# Altium project PRO_TA_THI_THU_PHUONG.PrjPcb
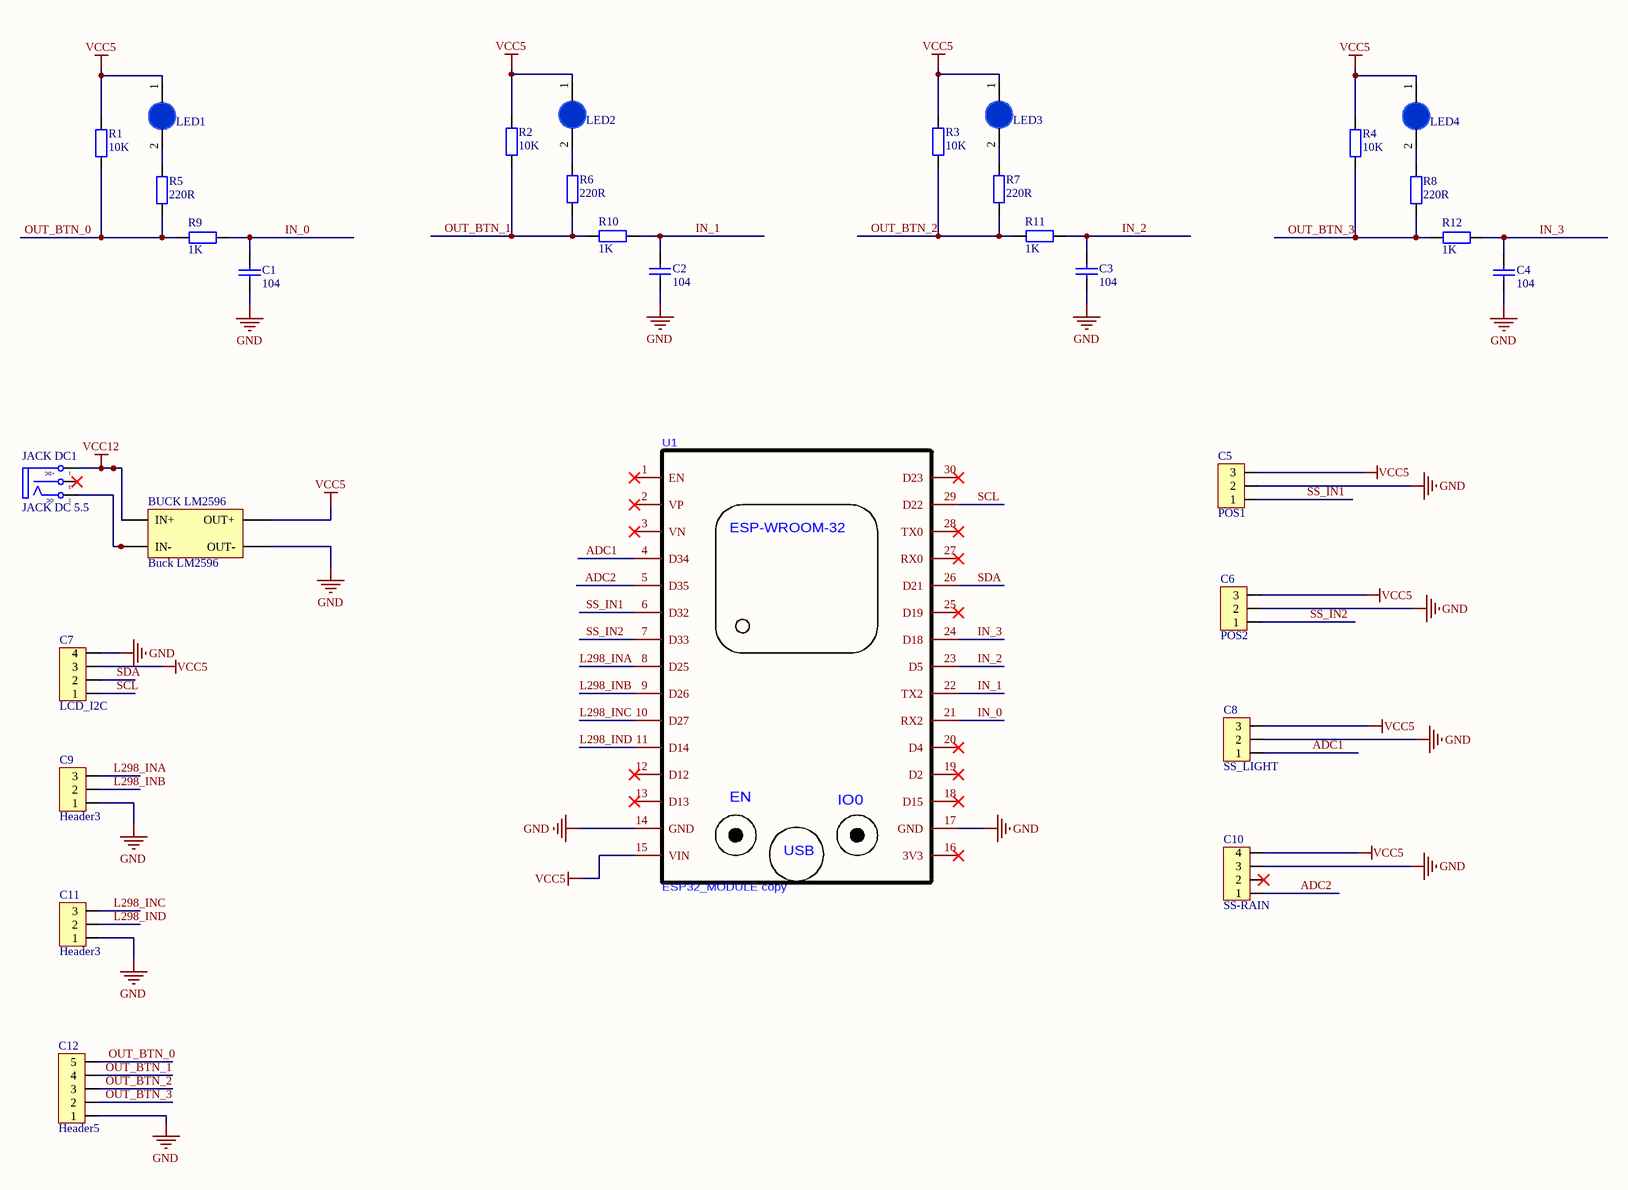
[diagram p0: SCHE_TA_THI_THU_PHUONG.SchDoc]
1 sheet, 31 parts. Net scope: global (net labels, ports and power ports of the same name join across sheets).
Board file: PCB_TA_THI_THU_PHUONG.PcbDoc

## Sheet SCHE_TA_THI_THU_PHUONG.SchDoc
size A2; SheetNumber: 1; SheetTotal: 1

### Parts
BUCK_LM2596  Buck LM2596  [BUCK LM2596]
C1  104  [tu gom]
C2  104  [tu gom]
C3  104  [tu gom]
C4  104  [tu gom]
C5  POS1  [Header3]
C6  POS2  [Header3]
C7  LCD_I2C  [Header4]
C8  SS_LIGHT  [Header3]
C9  Header3  [Header3]
C10  SS-RAIN  [Header4]
C11  Header3  [Header3]
C12  Header5  [Header5]
JACK_DC1  JACK DC 5.5  [JACK DC 5.5]
LED1  LED 3mm  [LED-3MM-BLUE]  (value not drawn)
LED2  LED 3mm  [LED-3MM-BLUE]  (value not drawn)
LED3  LED 3mm  [LED-3MM-BLUE]  (value not drawn)
LED4  LED 3mm  [LED-3MM-BLUE]  (value not drawn)
R1  10K  [R1/4W]
R2  10K  [R1/4W]
R3  10K  [R1/4W]
R4  10K  [R1/4W]
R5  220R  [R1/4W]
R6  220R  [R1/4W]
R7  220R  [R1/4W]
R8  220R  [R1/4W]
R9  1K  [R1/4W]
R10  1K  [R1/4W]
R11  1K  [R1/4W]
R12  1K  [R1/4W]
U1  ESP32_MODULE copy  [ESP32-WIFIMODULE-FOOTPRINT]

### Nets
GND: BUCK_LM2596.3(OUT-) C1.2 C2.2 C3.2 C4.2 C5.2 C6.2 C7.4 C8.2 C9.1 C10.3 C11.1 C12.1 U1.14(GND) U1.17(GND)
VCC5: BUCK_LM2596.4(OUT+) C5.3 C6.3 C7.3 C8.3 C10.4 LED1.1(A) LED2.1(A) LED3.1(A) LED4.1(A) R1.2 R2.2 R3.2 R4.2 U1.15(VIN)
VCC12: BUCK_LM2596.1(IN+) JACK_DC1.1(T)
ADC1: C8.1 U1.4(D34)
ADC2: C10.1 U1.5(D35)
IN_0: C1.1 R9.1 U1.21(RX2)
IN_1: C2.1 R10.1 U1.22(TX2)
IN_2: C3.1 R11.1 U1.23(D5)
IN_3: C4.1 R12.1 U1.24(D18)
L298_INA: C9.3 U1.8(D25)
L298_INB: C9.2 U1.9(D26)
L298_INC: C11.3 U1.10(D27)
L298_IND: C11.2 U1.11(D14)
OUT_BTN_0: C12.5 R1.1 R5.1 R9.2
OUT_BTN_1: C12.4 R2.1 R6.1 R10.2
OUT_BTN_2: C12.3 R3.1 R7.1 R11.2
OUT_BTN_3: C12.2 R4.1 R8.1 R12.2
SCL: C7.1 U1.29(D22)
SDA: C7.2 U1.26(D21)
SS_IN1: C5.1 U1.6(D32)
SS_IN2: C6.1 U1.7(D33)
NetBUCK_LM2596_2: BUCK_LM2596.2(IN-) JACK_DC1.2(TN)
NetLED1_2: LED1.2(K) R5.2
NetLED2_2: LED2.2(K) R6.2
NetLED3_2: LED3.2(K) R7.2
NetLED4_2: LED4.2(K) R8.2

Not connected (* = marked no-connect by the designer): C10 2*; JACK_DC1 3(S)*; U1 1(EN)* 2(VP)* 3(VN)* 12(D12)* 13(D13)* 16(3V3)* 18(D15)* 19(D2)* 20(D4)* 25(D19)* 27(RX0)* 28(TX0)* 30(D23)*

### Notes on the sheet
- (in symbol ESP32_MODULE copy) ESP-WROOM-32; IO0; USB
- (in symbol JACK DC 5.5) +DC; -DC

### Library data of the parts
C1-C4 = Tu gom 104 50V: Cắm; So_Chan: 2; Ten_Linh_Kien: Tụ gốm 104 100nF 50V; Don_Vi: Con; Ma_Hang: MH004761; Chung_Loai: Cắm; Kieu_Chan: *
C5 C6 C8 C9 C11 = Header3: Header IDC, 3 x 1 Pin Vertical 2.54mm Pitch (Non-Boxed, Male); Manufacturer: W¨¹rth Elektronik eiSos GmbH; partNo: 613002143121; ComponentLink1 Description: Manufacturer; ComponentLink2 Description: Datasheet; NoPins: 02; Created Date: 29 March 2013; ComponentLink1URL: http://www.we-online.com; ComponentLink2URL: http://katalog.we-online.de/em/datasheet/6130xx143121.pdf; Created by: Karrer Zheng
C7 C10 = Header4: Header IDC, 4 x 1 Pin Vertical 2.54mm Pitch (Non-Boxed, Male); Manufacturer: W¨¹rth Elektronik eiSos GmbH; partNo: 613002143121; ComponentLink1 Description: Manufacturer; ComponentLink2 Description: Datasheet; NoPins: 02; Created Date: 29 March 2013; ComponentLink1URL: http://www.we-online.com; ComponentLink2URL: http://katalog.we-online.de/em/datasheet/6130xx143121.pdf; Created by: Karrer Zheng
C12 = Header5: Header IDC, 5 x 1 Pin Vertical 2.54mm Pitch (Non-Boxed, Male); Manufacturer: W¨¹rth Elektronik eiSos GmbH; partNo: 613002143121; ComponentLink1 Description: Manufacturer; ComponentLink2 Description: Datasheet; NoPins: 02; Created Date: 29 March 2013; ComponentLink1URL: http://www.we-online.com; ComponentLink2URL: http://katalog.we-online.de/em/datasheet/6130xx143121.pdf; Created by: Karrer Zheng
JACK_DC1 = JACK DC 5.5: Value: Jac DC
LED1-LED4 = LED 3mm Xanh Duong: Cắm; Don_Vi: Con; Ma_Hang: MH009003; Ten_Linh_Kien: LED 3MM Xanh Dương SS (1000c); Ghi_Chu: *; Kieu_Chan: *; Chung_Loai: Cắm
R1-R12 = R1/4W: Resistor 1/4W; Value: R1/4W - 1K